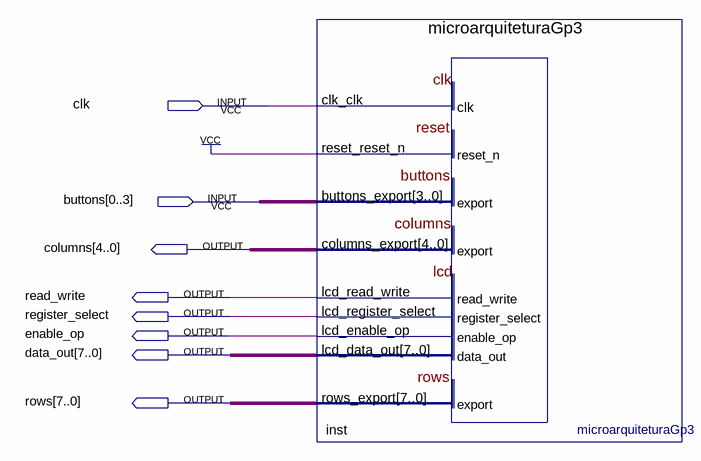
[diagram p0: schematic sheet]
// Quartus schematic microarquiteturaGp3.bdf as structural Verilog: 1 symbols, 8 pins
module microarquiteturaGp3 (
  input  clk,
  input  [0:3] buttons,
  output [4:0] columns,
  output read_write,
  output register_select,
  output enable_op,
  output [7:0] data_out,
  output [7:0] rows
);

  microarquiteturaGp3 inst (
    .clk_clk(clk), .reset_reset_n(1'b1), .buttons_export(buttons), .columns_export(columns),
    .lcd_read_write(read_write), .lcd_register_select(register_select), .lcd_enable_op(enable_op),
    .lcd_data_out(data_out), .rows_export(rows));
endmodule
